# Altium project ESP32-HomeHub.PrjPcb
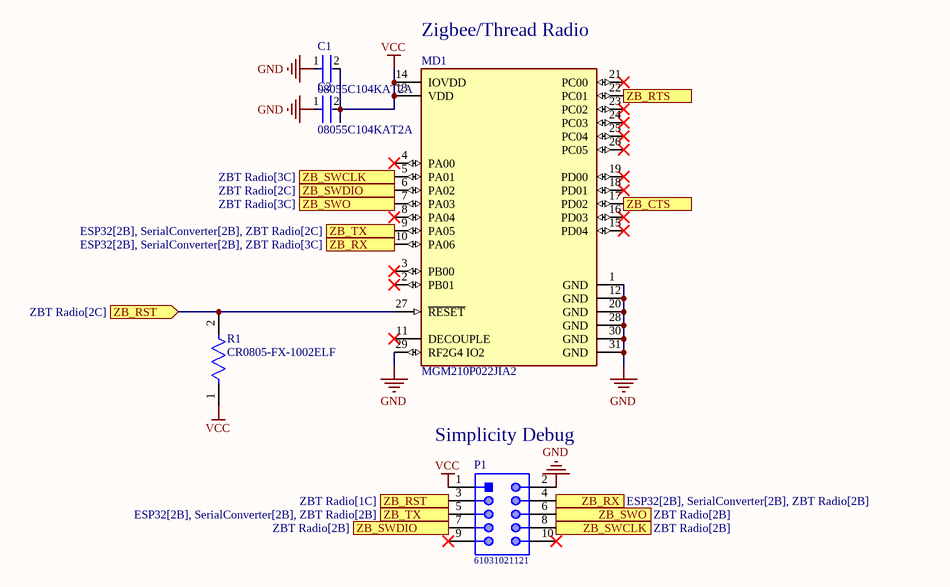
[diagram p0: ZBT Radio.SchDoc]
6 sheets, 52 parts. Net scope: flat (ports and power ports of the same name join across sheets).
Board file: PCB1.PcbDoc
Sheets:
  ZBT Radio.SchDoc
  ESP32.SchDoc
  SerialConverter.SchDoc
  Connectors.SchDoc
  PHY.SchDoc
  ZW Radio.SchDoc

## Sheet ZBT Radio.SchDoc
size A; SheetNumber: 1; SheetTotal: 6

### Parts
C1  08055C104KAT2A  [FP-0805-L_2_01_0_2-W_1_25-IPC_C]
C2  08055C104KAT2A  [FP-0805-L_2_01_0_2-W_1_25-IPC_C]
MD1  MGM210P022JIA2  [FP-MGM210P022JIA2-MFG]
P1  61031021121  [61031021121]
R1  CR0805-FX-1002ELF  [FP-CR0805-IPC_A]

### Ports
ZB_CTS, ZB_RST (in, see ZBT Radio[1C]), ZB_RST (in, see ZBT Radio[2C]), ZB_RTS, ZB_RX (in, see ESP32[2B], SerialConverter[2B], ZBT Radio[3C]), ZB_RX (out, see ESP32[2B], SerialConverter[2B], ZBT Radio[2B]), ZB_SWCLK (see ZBT Radio[2B]), ZB_SWCLK (see ZBT Radio[3C]), ZB_SWDIO (see ZBT Radio[2B]), ZB_SWDIO (see ZBT Radio[2C]), ZB_SWO (see ZBT Radio[2B]), ZB_SWO (see ZBT Radio[3C]), ZB_TX (in, see ESP32[2B], SerialConverter[2B], ZBT Radio[2B]), ZB_TX (out, see ESP32[2B], SerialConverter[2B], ZBT Radio[2C])

### Nets
GND: C1.1 C2.1 MD1.1(GND) MD1.12(GND) MD1.20(GND) MD1.28(GND) MD1.29(RF2G4_IO2) MD1.30(GND) MD1.31(GND) P1.2
VCC: C1.2 C2.2 MD1.13(VDD) MD1.14(IOVDD) P1.1 R1.1
ZB_CTS: MD1.17(PD02) ; port ZB_CTS
ZB_RST: MD1.27(~{RESET}) P1.3 R1.2 ; port ZB_RST
ZB_RTS: MD1.22(PC01) ; port ZB_RTS
ZB_RX: MD1.10(PA06) P1.4 ; port ZB_RX
ZB_SWCLK: MD1.5(PA01) P1.8 ; port ZB_SWCLK
ZB_SWDIO: MD1.6(PA02) P1.7 ; port ZB_SWDIO
ZB_SWO: MD1.7(PA03) P1.6 ; port ZB_SWO
ZB_TX: MD1.9(PA05) P1.5 ; port ZB_TX

Not connected (* = marked no-connect by the designer): MD1 2(PB01)* 3(PB00)* 4(PA00)* 8(PA04)* 11(DECOUPLE)* 15(PD04)* 16(PD03)* 18(PD01)* 19(PD00)* 21(PC00)* 23(PC02)* 24(PC03)* 25(PC04)* 26(PC05)*; P1 9* 10*

### Notes on the sheet
- (near MD1) Zigbee/Thread Radio
- (near P1) Simplicity Debug

### Library data of the parts
C1 C2 = CMP-2000-05016-2: General Purpose Ceramic Capacitor, 0805, 100nF, 10%, X7R, 0.15, 50V; Dissipation Factor: 2.5%; Insulation Resistance: 100GR; Voltage Rating (DC): 50V; Package Quantity: 4000; Tolerance: 10%; Voltage Rating: 50V; Dielectric: X7R; Case/Package: 0805; Lead Free: Lead Free; Dielectric Material: Ceramic; Thickness: 0.037inch; Weight: 0.001411oz; Max Operating Temperature: 125°C; REACH SVHC: No SVHC; Mount: Surface Mount; RoHS Compliant: Yes; Depth: 1.25mm; Height: 0.5mm; Case Code (Metric): 2012; Length: 2mm; Termination: Standard; Case Code (Imperial): 0805; Number of Pins: 2; Voltage: 50V; Radiation Hardening: No; Min Operating Temperature: -55°C; Capacitance: 100nF; Width: 1.2mm; Series: MLCC X7R; Packaging: Cut Tape
MD1 = CMP-08140-000019-1: RX TXRX MOD BLUETOOTH CHIP SMD
P1 = CMP-1502-01053-1: SMT Vertical Pin Header WR-PHD, Pitch 2.54 mm, Dual Row, 10 pins; Manufacturer: Wurth Elektronik; Gender: Male; Rated Current: 3A; Working Voltage: 250VAC; Withstanding Voltage: 500VAC; Pitch: 2.54mm; Pin Number: 10; Contact Resistance: 20mOhm; Packaging: TapeandReel; Part Number: 61031021121; Mounting Technology: SMT; Package Reference: 61031021121; Operating Temperature: -40to125degC; Manufacturer URL: http://www.we-online.de; Publisher: WurthElektronik; Datasheet URL: https://katalog.we-online.de/em/datasheet/6103xx21121.pdf; Orientation: Vertical; Row Number: Dual
R1 = CMP-07231-003204-1: Thick Film Chip Resistors 0805 10kΩ 0.125W 1% 100ppm/°C; Max Power Dissipation: 125mW; Voltage Rating: 150V; Voltage Rating (DC): 100V; Resistance: 10kR; Height: 0.5mm; Tolerance: 1%; Max Operating Temperature: 155°C; Thickness: 508um; Radiation Hardening: No; Packaging: Tape and Reel; Depth: 1.25mm; Contact Plating: Tin; Package Quantity: 1; Case Code (Metric): 2012; REACH SVHC: No SVHC; Min Operating Temperature: -55°C; Power Rating: 125mW; Mount: Surface Mount; Length: 2mm; Case Code (Imperial): 0805; Width: 1.25mm; Temperature Coefficient: 100ppm/°C; Termination: SMD/SMT; Composition: Thick Film; Features: Moisture Resistant; Case/Package: 0805; Number of Terminations: 2

## Sheet ESP32.SchDoc
size A; SheetNumber: 2; SheetTotal: 6
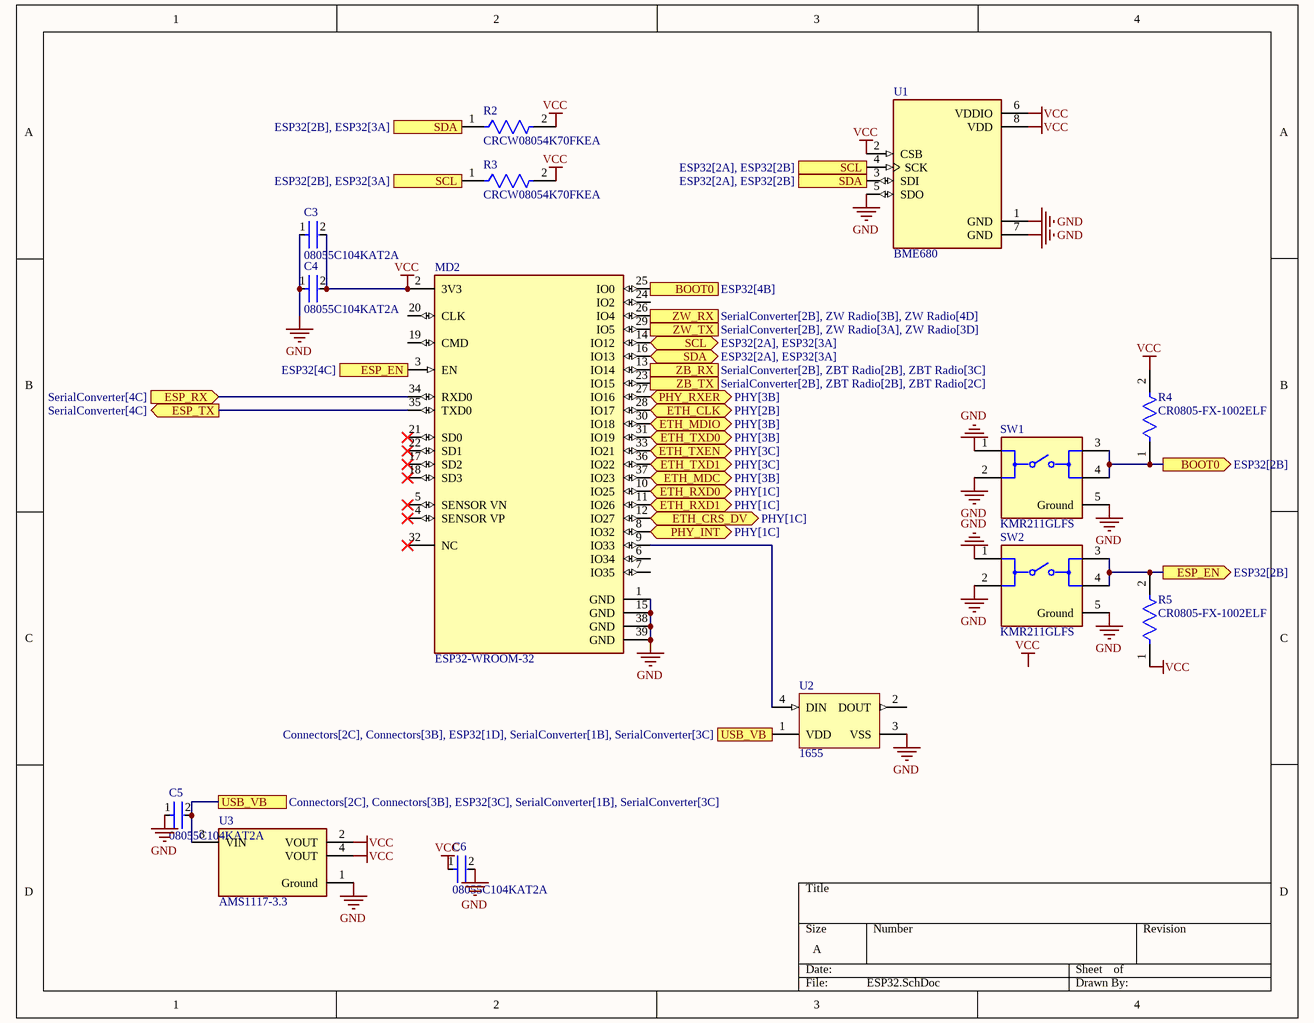
[diagram p1: ESP32.SchDoc]

### Parts
C3  08055C104KAT2A  [FP-0805-L_2_01_0_2-W_1_25-IPC_C]
C4  08055C104KAT2A  [FP-0805-L_2_01_0_2-W_1_25-IPC_C]
C5  08055C104KAT2A  [FP-0805-L_2_01_0_2-W_1_25-IPC_C]
C6  08055C104KAT2A  [FP-0805-L_2_01_0_2-W_1_25-IPC_C]
MD2  ESP32-WROOM-32  [FP-ESP32-WROOM-32-MFG]
R2  CRCW08054K70FKEA  [FP-CRCW0805-e3-IPC_B]
R3  CRCW08054K70FKEA  [FP-CRCW0805-e3-IPC_B]
R4  CR0805-FX-1002ELF  [FP-CR0805-IPC_A]
R5  CR0805-FX-1002ELF  [FP-CR0805-IPC_A]
SW1  KMR211GLFS  [FP-KMR211GLFS-MFG]
SW2  KMR211GLFS  [FP-KMR211GLFS-MFG]
U1  BME680  [PSON80P300X300X100-8N]
U2  1655  [ADA-RGB-1655_V]
U3  AMS1117-3.3  [FP-AMS1117-IPC_C]

### Ports
BOOT0 (in, see ESP32[4B]), BOOT0 (out, see ESP32[2B]), ESP_EN (in, see ESP32[4C]), ESP_EN (out, see ESP32[2B]), ESP_RX (in, see SerialConverter[4C]), ESP_TX (out, see SerialConverter[4C]), ETH_CLK (bidir, see PHY[2B]), ETH_CRS_DV (bidir, see PHY[1C]), ETH_MDC (bidir, see PHY[3B]), ETH_MDIO (bidir, see PHY[3B]), ETH_RXD0 (bidir, see PHY[1C]), ETH_RXD1 (bidir, see PHY[1C]), ETH_TXD0 (bidir, see PHY[3B]), ETH_TXD1 (bidir, see PHY[3C]), ETH_TXEN (bidir, see PHY[3C]), PHY_INT (bidir, see PHY[1C]), PHY_RXER (bidir, see PHY[3B]), SCL (bidir, see ESP32[2A], ESP32[3A]), SCL (see ESP32[2A], ESP32[2B]), SCL (see ESP32[2B], ESP32[3A]), SDA (bidir, see ESP32[2A], ESP32[3A]), SDA (see ESP32[2A], ESP32[2B]), SDA (see ESP32[2B], ESP32[3A]), USB_VB (see Connectors[2C], Connectors[3B], ESP32[1D], SerialConverter[1B], SerialConverter[3C]), USB_VB (see Connectors[2C], Connectors[3B], ESP32[3C], SerialConverter[1B], SerialConverter[3C]), ZB_RX (out, see SerialConverter[2B], ZBT Radio[2B], ZBT Radio[3C]), ZB_TX (in, see SerialConverter[2B], ZBT Radio[2B], ZBT Radio[2C]), ZW_RX (out, see SerialConverter[2B], ZW Radio[3B], ZW Radio[4D]), ZW_TX (in, see SerialConverter[2B], ZW Radio[3A], ZW Radio[3D])

### Nets
GND: C3.1 C4.1 C5.1 C6.2 MD2.1(GND) MD2.15(GND) MD2.38(GND) MD2.39(GND) SW1.1 SW1.2 SW1.5(Ground) SW2.1 SW2.2 SW2.5(Ground) U1.1(GND) U1.5(SDO) U1.7(GND) U2.3(VSS) U3.1(Ground)
VCC: C3.2 C4.2 C6.1 MD2.2(3V3) R2.2 R3.2 R4.2 R5.1 U1.2(CSB) U1.6(VDDIO) U1.8(VDD) U3.2(VOUT) U3.4(VOUT)
BOOT0: MD2.25(IO0) R4.1 SW1.3 SW1.4 ; port BOOT0
ESP_EN: MD2.3(EN) R5.2 SW2.3 SW2.4 ; port ESP_EN
ESP_RX: MD2.34(RXD0) ; port ESP_RX
ESP_TX: MD2.35(TXD0) ; port ESP_TX
ETH_CLK: MD2.28(IO17) ; port ETH_CLK
ETH_CRS_DV: MD2.12(IO27) ; port ETH_CRS_DV
ETH_MDC: MD2.37(IO23) ; port ETH_MDC
ETH_MDIO: MD2.30(IO18) ; port ETH_MDIO
ETH_RXD0: MD2.10(IO25) ; port ETH_RXD0
ETH_RXD1: MD2.11(IO26) ; port ETH_RXD1
ETH_TXD0: MD2.31(IO19) ; port ETH_TXD0
ETH_TXD1: MD2.36(IO22) ; port ETH_TXD1
ETH_TXEN: MD2.33(IO21) ; port ETH_TXEN
PHY_INT: MD2.8(IO32) ; port PHY_INT
PHY_RXER: MD2.27(IO16) ; port PHY_RXER
SCL: MD2.14(IO12) R3.1 U1.4(SCK) ; port SCL
SDA: MD2.16(IO13) R2.1 U1.3(SDI) ; port SDA
USB_VB: C5.2 U2.1(VDD) U3.3(VIN) ; port USB_VB
ZB_RX: MD2.13(IO14) ; port ZB_RX
ZB_TX: MD2.23(IO15) ; port ZB_TX
ZW_RX: MD2.26(IO4) ; port ZW_RX
ZW_TX: MD2.29(IO5) ; port ZW_TX
NetMD2_9: MD2.9(IO33) U2.4(DIN)

Not connected (* = marked no-connect by the designer): MD2 4(SENSOR_VP)* 5(SENSOR_VN)* 6(IO34) 7(IO35) 17(SD2)* 18(SD3)* 19(CMD) 20(CLK) 21(SD0)* 22(SD1)* 24(IO2) 32(NC)*; U2 2(DOUT)

### Notes on the sheet
- Labels drawn without touching a wire or pin: VCC

### Library data of the parts
C3-C6 = CMP-2000-05016-2: as C1 on sheet ZBT Radio; Voltage Rating (DC): 50V; Package Quantity: 4000; Tolerance: 10%; Voltage Rating: 50V; Dielectric: X7R; Case/Package: 0805; Lead Free: Lead Free; Dielectric Material: Ceramic; Thickness: 0.037inch; Weight: 0.001411oz; Max Operating Temperature: 125°C; REACH SVHC: No SVHC; Mount: Surface Mount; RoHS Compliant: Yes; Depth: 1.25mm; Height: 0.5mm; Case Code (Metric): 2012; Length: 2mm; Termination: Standard; Case Code (Imperial): 0805; Number of Pins: 2; Voltage: 50V; Radiation Hardening: No; Min Operating Temperature: -55°C; Capacitance: 100nF; Width: 1.2mm; Series: MLCC X7R; Packaging: Cut Tape
MD2 = CMP-194065-000008-1: RX TXRX MOD WIFI SURFACE MOUNT; Frequency: 2.5GHz; Sensitivity: -98dBm; Operating Supply Voltage: 3.6V; Data Rate: 150Mbps; Weight: 0.088185oz; Package Quantity: 550; Min Operating Temperature: -40°C; Mount: Surface Mount; Max Operating Temperature: 85°C; Packaging: Cut Tape; Case/Package: SMD/SMT
R2 R3 = CMP-2100-03615-2: RES Thick Film, 4.7kΩ, 1%, 0.125W, 100ppm/°C, 0805; Max Power Dissipation: 125mW; Resistance: 4.7kR; Voltage Rating: 150V; Termination: SMD/SMT; Weight: 0.000194oz; Case/Package: 0805; Number of Terminations: 2; Min Operating Temperature: -55°C; Case Code (Metric): 2012; Package Quantity: 10; Depth: 1.25mm; Military Standard: Not; Composition: Thick Film; Radiation Hardening: No; Contact Plating: Tin; Height: 0.45mm; Power Rating: 125mW; Features: Automotive AEC-Q200; Tolerance: 1%; Packaging: Tape and Reel; Max Operating Temperature: 155°C; Length: 2mm; Case Code (Imperial): 0805; Voltage Rating (DC): 150V; Width: 1.25mm; Temperature Coefficient: 100ppm/°C; Lead Free: Lead Free
R4 R5 = CMP-07231-003204-1: as R1 on sheet ZBT Radio; Height: 0.5mm; Tolerance: 1%; Max Operating Temperature: 155°C; Thickness: 508um; Radiation Hardening: No; Packaging: Tape and Reel; Depth: 1.25mm; Contact Plating: Tin; Package Quantity: 1; Case Code (Metric): 2012; REACH SVHC: No SVHC; Min Operating Temperature: -55°C; Power Rating: 125mW; Mount: Surface Mount; Length: 2mm; Case Code (Imperial): 0805; Width: 1.25mm; Temperature Coefficient: 100ppm/°C; Termination: SMD/SMT; Composition: Thick Film; Features: Moisture Resistant; Case/Package: 0805; Number of Terminations: 2
SW1 SW2 = CMP-10040-000023-1: SWITCH TACTILE SPST-NO 0.05A 32V; Switch Function: Off-Mom; Throw Configuration: SPST; Switch Travel: 0.2mm; Current Rating: 50mA; Illumination Type: Non-Illuminated; Actuator Length: 0.5mm; Power Rating: 1W; Operating Force: 1.2N; Actuator Type: Standard; Mechanical Life: 200000Cycles; REACH SVHC: No SVHC; Voltage Rating (DC): 32V; Length: 2.8mm; Min Operating Temperature: -40°C; Mount: Surface Mount; Max Voltage Rating (DC): 32V; Width: 2.8mm; Depth: 4.6mm; Packaging: Tape and Reel; Lead Free: Lead Free; Contact Material: Silver; Termination: Gull Wing; Package Quantity: 1; Contact Current Rating: 50mA; Orientation: Straight; Max Operating Temperature: 85°C; Radiation Hardening: No; Max Current Rating: 50mA; Contact Plating: Silver
U1 = BME680: Integrated Environmental Unit; MF: {'manufacturer': u'Bosch Sensortec'}; Package: None; Price: None; Value: *; MP: BME680; Availability: Unavailable
U2 = CMP-2000-05026-1: Intelligent Control LED Integrated Light Source, 3.5 to 5.3 V, -25 to 80 degC, 4-Pin SMD, RoHS, Tape and Reel; Manufacturer: Adafruit-Industries-LLC; Number of LEDs: 10; Configuration: Discrete; Utilized LED: WS2812(5050); Datasheet URL: http://datasheet.octopart.com/ADA1655-Adafruit-Industries-datasheet-32028139.pdf; Series: Neopixel; Interface: -; Package Description: 4-Pin Surface Mount Device, Body 5 x 5 mm; Color: Red,Green,Blue(RGB); Category: Optoelectronics; Controller Type: -; Package Reference: 1655; Manufacturer URL: https://www.adafruit.com/; Mounting Type: SurfaceMount; Datasheet Version: May-13; Size / Dimension: 5.00mmLx5.00mmW; Family: Addressable,Specialty
U3 = CMP-209535-000001-1: LDO Voltage Regulators 1A, 3.3V; Manufacturer: Advanced Monolithic Systems; Dropout Voltage: 1.1V; Output Type: Fixed; Nominal Supply Current: 5mA; Max Power Dissipation: 1.2W; Max Supply Voltage: 15V; Number Of Outputs: 1; Standoff Height: 0.64mm; Max Junction Temp: +125°C; Height: 1.8mm; Package: AMS1117; Device Class L2: Power Management ICs; ComponentLink2Description: Datasheet; ComponentLink2URL: http://www.advanced-monolithic.com/pdf/ds1117.pdf; Category: IC; RoHS: TRUE; Automotive: No; Device Class L1: Integrated Circuits (ICs); Output Current: 1A; Device Class L3: Voltage Regulators - Linear; Temperature: -40°C to +125°C; Output Voltage: 3.3V; Manufacturer Part Number: AMS1117-3.3; Temperature Range Low: -40°C; Octopart: https://octopart.com/ams1117-3.3-advanced+monolithic+systems-25899300; Lead Free: Yes; Ipc Land Pattern Name: SOT229P700X180-4; Temperature Range High: +125°C

## Sheet SerialConverter.SchDoc
size A; SheetNumber: 3; SheetTotal: 6
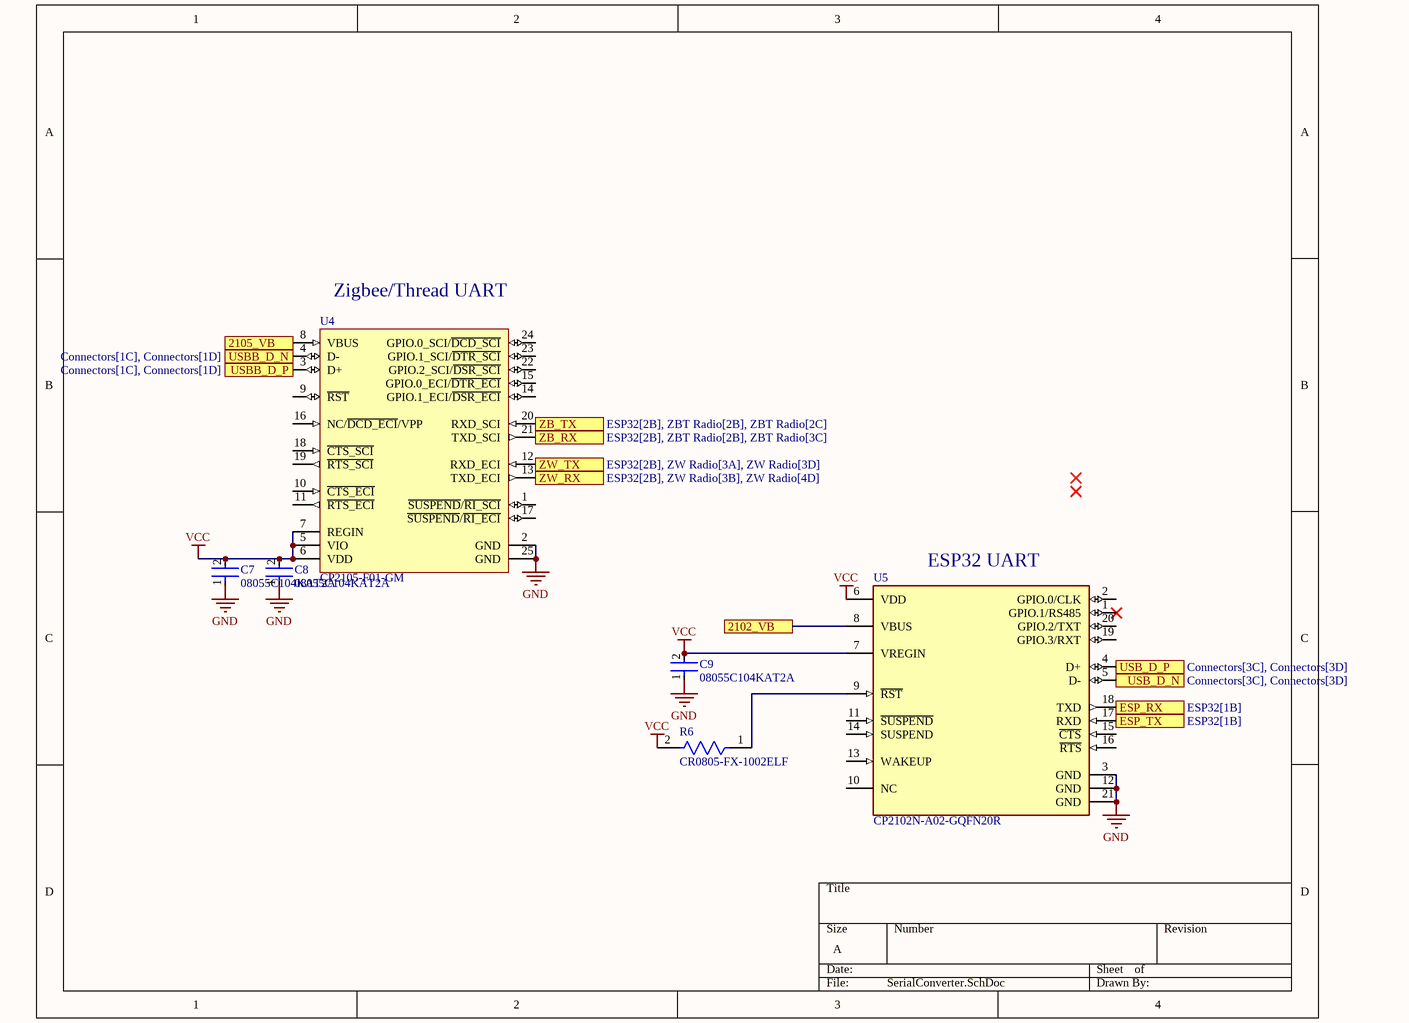
[diagram p2: SerialConverter.SchDoc]

### Parts
C7  08055C104KAT2A  [FP-0805-L_2_01_0_2-W_1_25-IPC_C]
C8  08055C104KAT2A  [FP-0805-L_2_01_0_2-W_1_25-IPC_C]
C9  08055C104KAT2A  [FP-0805-L_2_01_0_2-W_1_25-IPC_C]
R6  CR0805-FX-1002ELF  [FP-CR0805-IPC_A]
U4  CP2105-F01-GM  [SLAB-QFN-24-2675x2675TP_N]
U5  CP2102N-A02-GQFN20R  [FP-CP2102N-A02-GQFN20R-MFG]

### Ports
2102_VB, 2105_VB, ESP_RX (out, see ESP32[1B]), ESP_TX (in, see ESP32[1B]), USB_D_N (see Connectors[3C], Connectors[3D]), USB_D_P (see Connectors[3C], Connectors[3D]), USBB_D_N (see Connectors[1C], Connectors[1D]), USBB_D_P (see Connectors[1C], Connectors[1D]), ZB_RX (out, see ESP32[2B], ZBT Radio[2B], ZBT Radio[3C]), ZB_TX (in, see ESP32[2B], ZBT Radio[2B], ZBT Radio[2C]), ZW_RX (out, see ESP32[2B], ZW Radio[3B], ZW Radio[4D]), ZW_TX (in, see ESP32[2B], ZW Radio[3A], ZW Radio[3D])

### Nets
GND: C7.1 C8.1 C9.1 U4.2(GND) U4.25(GND) U5.3(GND) U5.12(GND) U5.21(GND)
VCC: C7.2 C8.2 C9.2 R6.2 U4.5(VIO) U4.6(VDD) U4.7(REGIN) U5.6(VDD) U5.7(VREGIN)
2102_VB: U5.8(VBUS) ; port 2102_VB
2105_VB: U4.8(VBUS) ; port 2105_VB
ESP_RX: U5.18(TXD) ; port ESP_RX
ESP_TX: U5.17(RXD) ; port ESP_TX
USB_D_N: U5.5(D-) ; port USB_D_N
USB_D_P: U5.4(D+) ; port USB_D_P
USBB_D_N: U4.4(D-) ; port USBB_D_N
USBB_D_P: U4.3(D+) ; port USBB_D_P
ZB_RX: U4.21(TXD_SCI) ; port ZB_RX
ZB_TX: U4.20(RXD_SCI) ; port ZB_TX
ZW_RX: U4.13(TXD_ECI) ; port ZW_RX
ZW_TX: U4.12(RXD_ECI) ; port ZW_TX
NetR6_1: R6.1 U5.9(~{RST})

Not connected (* = marked no-connect by the designer): U4 1(~{SUSPEND}/~{RI_SCI}) 9(~{RST}) 10(~{CTS_ECI}) 11(~{RTS_ECI}) 14(GPIO.1_ECI/~{DSR_ECI}) 15(GPIO.0_ECI/~{DTR_ECI}) 16(NC/~{DCD_ECI}/VPP) 17(~{SUSPEND}/~{RI_ECI}) 18(~{CTS_SCI}) 19(~{RTS_SCI}) 22(GPIO.2_SCI/~{DSR_SCI}) 23(GPIO.1_SCI/~{DTR_SCI}) 24(GPIO.0_SCI/~{DCD_SCI}); U5 1(GPIO.1/RS485)* 2(GPIO.0/CLK) 10(NC) 11(~{SUSPEND}) 13(WAKEUP) 14(SUSPEND) 15(~{CTS}) 16(~{RTS}) 19(GPIO.3/RXT) 20(GPIO.2/TXT)

### Notes on the sheet
- (near U4) Zigbee/Thread UART
- (near U5) ESP32 UART

### Library data of the parts
C7-C9 = CMP-2000-05016-2: as C1 on sheet ZBT Radio; Voltage Rating (DC): 50V; Package Quantity: 4000; Tolerance: 10%; Voltage Rating: 50V; Dielectric: X7R; Case/Package: 0805; Lead Free: Lead Free; Dielectric Material: Ceramic; Thickness: 0.037inch; Weight: 0.001411oz; Max Operating Temperature: 125°C; REACH SVHC: No SVHC; Mount: Surface Mount; RoHS Compliant: Yes; Depth: 1.25mm; Height: 0.5mm; Case Code (Metric): 2012; Length: 2mm; Termination: Standard; Case Code (Imperial): 0805; Number of Pins: 2; Voltage: 50V; Radiation Hardening: No; Min Operating Temperature: -55°C; Capacitance: 100nF; Width: 1.2mm; Series: MLCC X7R; Packaging: Cut Tape
R6 = CMP-07231-003204-1: as R1 on sheet ZBT Radio; Height: 0.5mm; Tolerance: 1%; Max Operating Temperature: 155°C; Thickness: 508um; Radiation Hardening: No; Packaging: Tape and Reel; Depth: 1.25mm; Contact Plating: Tin; Package Quantity: 1; Case Code (Metric): 2012; REACH SVHC: No SVHC; Min Operating Temperature: -55°C; Power Rating: 125mW; Mount: Surface Mount; Length: 2mm; Case Code (Imperial): 0805; Width: 1.25mm; Temperature Coefficient: 100ppm/°C; Termination: SMD/SMT; Composition: Thick Film; Features: Moisture Resistant; Case/Package: 0805; Number of Terminations: 2
U4 = CMP-0511-00003-1: Single-Chip USB to Dual UART Bridge, 5 Dig I/O Pins, Internal Oscillator, 296 Bytes EEPROM, -40 to 85 degC, 24-pin QFN; Manufacturer: Silicon Labs; Internal Oscillator: TRUE; Sub-Family: USB Bridges; ComponentLink3URL: http://www.silabs.com/Support%20Documents/TechnicalDocs/C8051F93x-92x.pdf; PartNumber: CP2105-F01-GM; PackageDescription: 24-Pin Quad-Flat No-Leads Package, Body 4 x 4 mm, Pitch 0.5 mm; Code_JEDEC: MO-220; ComponentLink2URL: http://www.silabs.com/Support%20Documents/TechnicalDocs/CP2105.pdf; Mounting Technology: Surface Mount; ComponentLink1URL: http://www.silabs.com/; ComponentLink1Description: Manufacturer URL; EEPROM: 296 Bytes; ComponentLink2Description: Datasheet; ComponentLink3Description: Package Specification; Code_IPC: J-STD-020; DatasheetVersion: Rev. 1.0; PackageReference: QFN-24
U5 = CMP-08107-000007-1: IC USB TO UART BRIDGE QFN20

## Sheet Connectors.SchDoc
size A; SheetNumber: 4; SheetTotal: 6
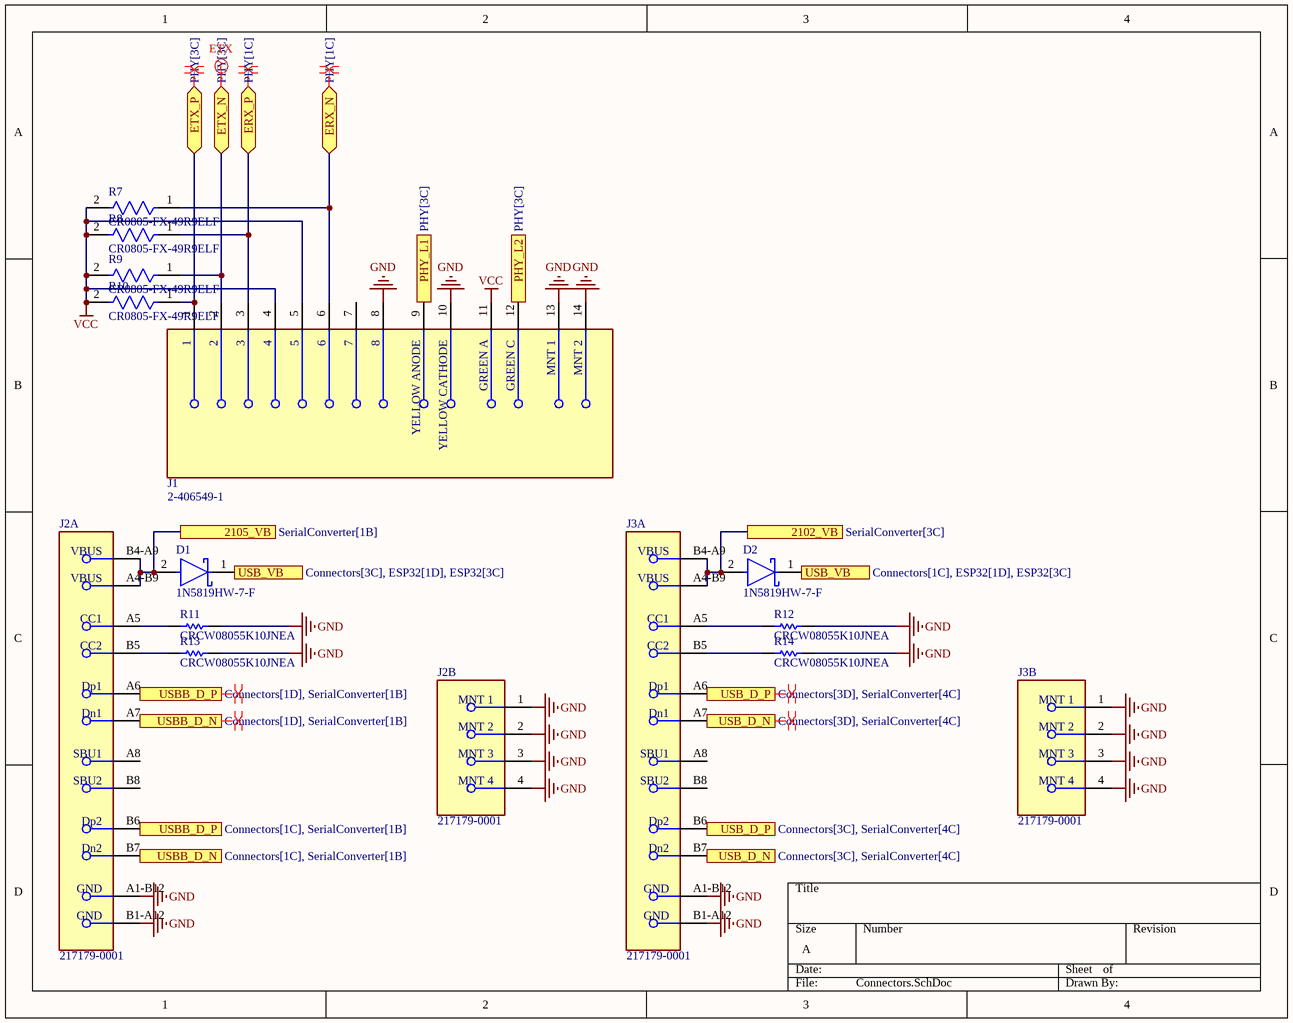
[diagram p3: Connectors.SchDoc]

### Parts
D1  1N5819HW-7-F  [FP-SOD123-IPC_A]
D2  1N5819HW-7-F  [FP-SOD123-IPC_A]
J1  2-406549-1  [FP-2-406549-1-MFG]
J2  217179-0001  [FP-217179-0001-MFG]  (parts A,B of 2)
J3  217179-0001  [FP-217179-0001-MFG]  (parts A,B of 2)
R7  CR0805-FX-49R9ELF  [FP-CR0805-MFG]
R8  CR0805-FX-49R9ELF  [FP-CR0805-MFG]
R9  CR0805-FX-49R9ELF  [FP-CR0805-MFG]
R10  CR0805-FX-49R9ELF  [FP-CR0805-MFG]
R11  CRCW08055K10JNEA  [RESC2013X50X30LL20T20]
R12  CRCW08055K10JNEA  [RESC2013X50X30LL20T20]
R13  CRCW08055K10JNEA  [RESC2013X50X30LL20T20]
R14  CRCW08055K10JNEA  [RESC2013X50X30LL20T20]

### Ports
2102_VB (see SerialConverter[3C]), 2105_VB (see SerialConverter[1B]), ERX_N (bidir, see PHY[1C]), ERX_P (bidir, see PHY[1C]), ETX_N (bidir, see PHY[3C]), ETX_P (bidir, see PHY[3C]), PHY_L1 (in, see PHY[3C]), PHY_L2 (out, see PHY[3C]), USB_D_N (see Connectors[3C], SerialConverter[4C]), USB_D_N (see Connectors[3D], SerialConverter[4C]), USB_D_P (see Connectors[3C], SerialConverter[4C]), USB_D_P (see Connectors[3D], SerialConverter[4C]), USB_VB (see Connectors[1C], ESP32[1D], ESP32[3C]), USB_VB (see Connectors[3C], ESP32[1D], ESP32[3C]), USBB_D_N (see Connectors[1C], SerialConverter[1B]), USBB_D_N (see Connectors[1D], SerialConverter[1B]), USBB_D_P (see Connectors[1C], SerialConverter[1B]), USBB_D_P (see Connectors[1D], SerialConverter[1B])

### Nets
GND: J1.8 J1.10(YELLOW_CATHODE) J1.13(MNT_1) J1.14(MNT_2) J2.1(MNT_1) J2.2(MNT_2) J2.3(MNT_3) J2.4(MNT_4) J2.A1-B12(GND) J2.B1-A12(GND) J3.1(MNT_1) J3.2(MNT_2) J3.3(MNT_3) J3.4(MNT_4) J3.A1-B12(GND) J3.B1-A12(GND) R11.2 R12.2 R13.2 R14.2
VCC: J1.4 J1.5 J1.11(GREEN_A) R7.2 R8.2 R9.2 R10.2
2102_VB: D2.2(A) J3.A4-B9(VBUS) J3.B4-A9(VBUS) ; port 2102_VB
2105_VB: D1.2(A) J2.A4-B9(VBUS) J2.B4-A9(VBUS) ; port 2105_VB
ERX_N: J1.6 R7.1 ; port ERX_N
ERX_P: J1.3 R8.1 ; port ERX_P
ETX_N: J1.2 R9.1 ; port ETX_N
ETX_P: J1.1 R10.1 ; port ETX_P
PHY_L1: J1.9(YELLOW_ANODE) ; port PHY_L1
PHY_L2: J1.12(GREEN_C) ; port PHY_L2
USB_D_N: J3.A7(Dn1) J3.B7(Dn2) ; port USB_D_N
USB_D_P: J3.A6(Dp1) J3.B6(Dp2) ; port USB_D_P
USB_VB: D1.1(C) D2.1(C) ; port USB_VB
USBB_D_N: J2.A7(Dn1) J2.B7(Dn2) ; port USBB_D_N
USBB_D_P: J2.A6(Dp1) J2.B6(Dp2) ; port USBB_D_P
NetJ2_A5: J2.A5(CC1) R11.1
NetJ2_B5: J2.B5(CC2) R13.1
NetJ3_A5: J3.A5(CC1) R12.1
NetJ3_B5: J3.B5(CC2) R14.1

Not connected (* = marked no-connect by the designer): J1 7; J2 A8(SBU1) B8(SBU2); J3 A8(SBU1) B8(SBU2)

### Layout directives
differential pair: ERX_N, ERX_P, ETX_N, ETX_P, USB_D_N, USB_D_P, USBB_D_N, USBB_D_P

### Library data of the parts
D1 D2 = CMP-0303-00003-3: DIODE SCHOTTKY 40V 1A SOD123; Forward Voltage: 450mV; Capacitance: 110pF; Max Forward Surge Current (Ifsm): 25A; Peak Reverse Current: 50uA; Polarity: Standard; Element Configuration: Single; Max Power Dissipation: 450mW; Min Operating Temperature: -65°C; Package Quantity: 3000; Contact Plating: Tin; Weight: 0.000353oz; Max Repetitive Reverse Voltage (Vrrm): 40V; Max Reverse Voltage (DC): 40V; Height: 1.25mm; Average Rectified Current: 1A; Width: 1.7mm; Case/Package: SOD-123-2; Lead Free: Lead Free; Max Operating Temperature: 125°C; Current Rating: 1A; Termination: SMD/SMT; Forward Current: 1A; Radiation Hardening: No; Number of Pins: 2; Length: 2.85mm; Voltage Rating (DC): 40V; REACH SVHC: No SVHC; Peak Non-Repetitive Surge Current: 25A; Packaging: Tape and Reel; Output Current: 1A
J1 = CMP-2000-05541-2: CONN MOD JACK 8P8C R/A SHIELDED; Max Voltage Rating (AC): 150V; Number of Contacts: 8; PCB Mounting Orientation: Right Angle; Direction: Up; Pitch: 2.03mm; Number of Ports: 1; Gender: Female; Tail Length: 2.54mm; Current Rating: 1.5A; Keyed: No; Approvals: UL; PCB Thickness: 1.57mm; Element Configuration: Single; Connector Type: Jack; Color: Yellow; Max Operating Temperature: 85°C; Weight: 0.144729oz; Series: -; Orientation: Right Angle; Width: 17.27mm; Package Quantity: 63; Mount: Panel; Contact Plating: Gold; Length: 17.86mm; Depth: 15.75mm; Flammability Rating: UL94 V-0; Shielding: Shielded; Housing Material: Thermoplastic; Number of Positions Loaded: 8; Contact Material: Bronze; Voltage Rating: 150V; Packaging: Tray; Number of Positions: 8; Termination: Solder; Number of Rows: 1; Radiation Hardening: No; Min Operating Temperature: -40°C; RoHS Compliant: Yes; Housing Color: Black
J2 J3 = CMP-04767-000028-1: CONN RCP USB2.0 TYP C 24P SMD RA
R7-R10 = CMP-07231-001472-1: Thick Film Chip Resistors 0805 49.9Ω 0.125W 1% 100ppm/°C; Voltage Rating (DC): 150V; Power Rating: 125mW; Resistance: 49.9R; Contact Plating: Tin; Radiation Hardening: No; Height: 0.5mm; Tolerance: 1%; Temperature Coefficient: 100ppm/°C; Min Operating Temperature: -55°C; Thickness: 508um; Termination: SMD/SMT; Depth: 1.25mm; Length: 2mm; Number of Pins: 2; Military Standard: Not; Case Code (Metric): 2012; Package Quantity: 5000; Width: 1.25mm; Mount: Surface Mount; Case Code (Imperial): 0805; Max Operating Temperature: 155°C; Voltage Rating: 150V; Composition: Thick Film; Case/Package: 0805; Packaging: Tape and Reel; REACH SVHC: No SVHC
R11-R14 = CMP-2001-04025-1: Manufacturer: Vishay Dale; Part Number: CRCW08055K10JNEA

## Sheet PHY.SchDoc
size A; SheetNumber: 5; SheetTotal: 6
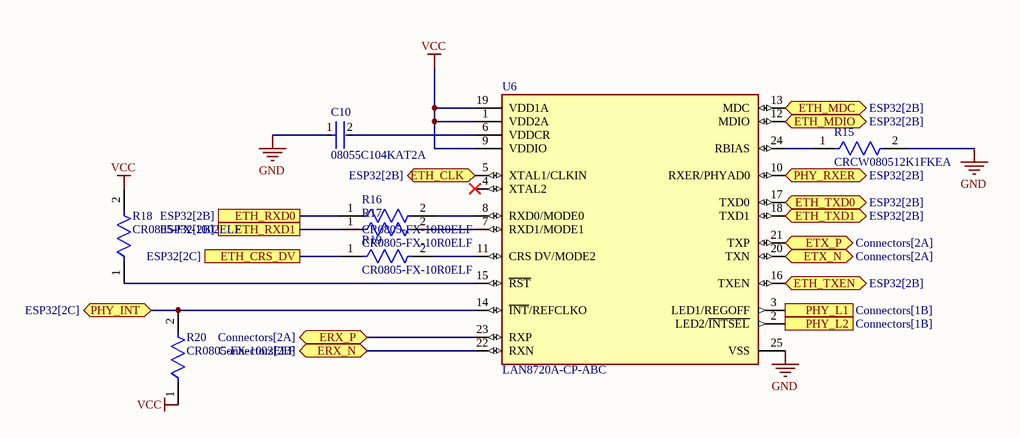
[diagram p4: PHY.SchDoc]

### Parts
C10  08055C104KAT2A  [FP-0805-L_2_01_0_2-W_1_25-IPC_C]
R15  CRCW080512K1FKEA  [FP-CRCW0805-e3-IPC_B]
R16  CR0805-FX-10R0ELF  [FP-CR0805-IPC_B]
R17  CR0805-FX-10R0ELF  [FP-CR0805-IPC_B]
R18  CR0805-FX-1002ELF  [FP-CR0805-IPC_A]
R19  CR0805-FX-10R0ELF  [FP-CR0805-IPC_B]
R20  CR0805-FX-1002ELF  [FP-CR0805-IPC_A]
U6  LAN8720A-CP-ABC  [FP-24-S4QFN-4x4B-0_5P-IPC_B]

### Ports
ERX_N (bidir, see Connectors[2B]), ERX_P (bidir, see Connectors[2A]), ETH_CLK (bidir, see ESP32[2B]), ETH_CRS_DV (see ESP32[2C]), ETH_MDC (bidir, see ESP32[2B]), ETH_MDIO (bidir, see ESP32[2B]), ETH_RXD0 (see ESP32[2B]), ETH_RXD1 (see ESP32[2B]), ETH_TXD0 (bidir, see ESP32[2B]), ETH_TXD1 (bidir, see ESP32[2B]), ETH_TXEN (bidir, see ESP32[2B]), ETX_N (bidir, see Connectors[2A]), ETX_P (bidir, see Connectors[2A]), PHY_INT (bidir, see ESP32[2C]), PHY_L1 (out, see Connectors[1B]), PHY_L2 (out, see Connectors[1B]), PHY_RXER (bidir, see ESP32[2B])

### Nets
GND: C10.1 R15.2 U6.25(VSS)
VCC: R18.2 R20.1 U6.1(VDD2A) U6.9(VDDIO) U6.19(VDD1A)
ERX_N: U6.22(RXN) ; port ERX_N
ERX_P: U6.23(RXP) ; port ERX_P
ETH_CLK: U6.5(XTAL1/CLKIN) ; port ETH_CLK
ETH_CRS_DV: R19.1 ; port ETH_CRS_DV
ETH_MDC: U6.13(MDC) ; port ETH_MDC
ETH_MDIO: U6.12(MDIO) ; port ETH_MDIO
ETH_RXD0: R16.1 ; port ETH_RXD0
ETH_RXD1: R17.1 ; port ETH_RXD1
ETH_TXD0: U6.17(TXD0) ; port ETH_TXD0
ETH_TXD1: U6.18(TXD1) ; port ETH_TXD1
ETH_TXEN: U6.16(TXEN) ; port ETH_TXEN
ETX_N: U6.20(TXN) ; port ETX_N
ETX_P: U6.21(TXP) ; port ETX_P
PHY_INT: R20.2 U6.14(~{INT}/REFCLKO) ; port PHY_INT
PHY_L1: U6.3(LED1/REGOFF) ; port PHY_L1
PHY_L2: U6.2(LED2/~{INTSEL}) ; port PHY_L2
PHY_RXER: U6.10(RXER/PHYAD0) ; port PHY_RXER
NetC10_2: C10.2 U6.6(VDDCR)
NetR15_1: R15.1 U6.24(RBIAS)
NetR16_2: R16.2 U6.8(RXD0/MODE0)
NetR17_2: R17.2 U6.7(RXD1/MODE1)
NetR18_1: R18.1 U6.15(~{RST})
NetR19_2: R19.2 U6.11(CRS_DV/MODE2)

Not connected (* = marked no-connect by the designer): U6 4(XTAL2)*

### Library data of the parts
C10 = CMP-2000-05016-2: as C1 on sheet ZBT Radio; Voltage Rating (DC): 50V; Package Quantity: 4000; Tolerance: 10%; Voltage Rating: 50V; Dielectric: X7R; Case/Package: 0805; Lead Free: Lead Free; Dielectric Material: Ceramic; Thickness: 0.037inch; Weight: 0.001411oz; Max Operating Temperature: 125°C; REACH SVHC: No SVHC; Mount: Surface Mount; RoHS Compliant: Yes; Depth: 1.25mm; Height: 0.5mm; Case Code (Metric): 2012; Length: 2mm; Termination: Standard; Case Code (Imperial): 0805; Number of Pins: 2; Voltage: 50V; Radiation Hardening: No; Min Operating Temperature: -55°C; Capacitance: 100nF; Width: 1.2mm; Series: MLCC X7R; Packaging: Cut Tape
R15 = CMP-2001-04935-2: RES Thick Film, 12.1kΩ, 1%, 0.125W, 100ppm/°C, 0805; Max Power Dissipation: 125mW; Resistance: 12.1kR; Voltage Rating: 150V; Min Operating Temperature: -55°C; Power Rating: 125mW; Length: 2mm; Tolerance: 1%; Termination: SMD/SMT; Height: 0.45mm; Radiation Hardening: No; Case/Package: 0805; Packaging: Tape and Reel; Lead Free: Lead Free; Military Standard: Not; Max Operating Temperature: 155°C; Features: Automotive AEC-Q200; Voltage Rating (DC): 150V; Width: 0.049inch; Case Code (Imperial): 0805; Depth: 1.25mm; Temperature Coefficient: 100ppm/°C; Weight: 0.000194oz; Composition: Thick Film; Case Code (Metric): 2012; Number of Terminations: 2; Package Quantity: 10; Contact Plating: Tin
R16 R17 R19 = CMP-07231-004657-1: Thick Film Chip Resistors 0805 10Ω 0.125W 1% 100ppm/°C; Voltage Rating (DC): 150V; Resistance: 10R; Power Rating: 125mW; Tolerance: 1%; Min Operating Temperature: -55°C; Length: 2mm; Case Code (Metric): 2012; Temperature Coefficient: 100ppm/°C; Height: 0.5mm; Max Operating Temperature: 155°C; Case/Package: 0805; Width: 1.25mm; Composition: Thick Film; Contact Plating: Tin; Termination: SMD/SMT; Packaging: Tape and Reel; REACH SVHC: No SVHC; Number of Pins: 2; Package Quantity: 5000; Mount: Surface Mount; Military Standard: Not; Thickness: 508um; Case Code (Imperial): 0805; Depth: 1.25mm; Radiation Hardening: No; Voltage Rating: 150V
R18 R20 = CMP-07231-003204-1: as R1 on sheet ZBT Radio; Height: 0.5mm; Tolerance: 1%; Max Operating Temperature: 155°C; Thickness: 508um; Radiation Hardening: No; Packaging: Tape and Reel; Depth: 1.25mm; Contact Plating: Tin; Package Quantity: 1; Case Code (Metric): 2012; REACH SVHC: No SVHC; Min Operating Temperature: -55°C; Power Rating: 125mW; Mount: Surface Mount; Length: 2mm; Case Code (Imperial): 0805; Width: 1.25mm; Temperature Coefficient: 100ppm/°C; Termination: SMD/SMT; Composition: Thick Film; Features: Moisture Resistant; Case/Package: 0805; Number of Terminations: 2
U6 = CMP-06281-000057-1: IC TRANSCEIVER FULL 2/2 24SQFN

## Sheet ZW Radio.SchDoc
size A; SheetNumber: 6; SheetTotal: 6
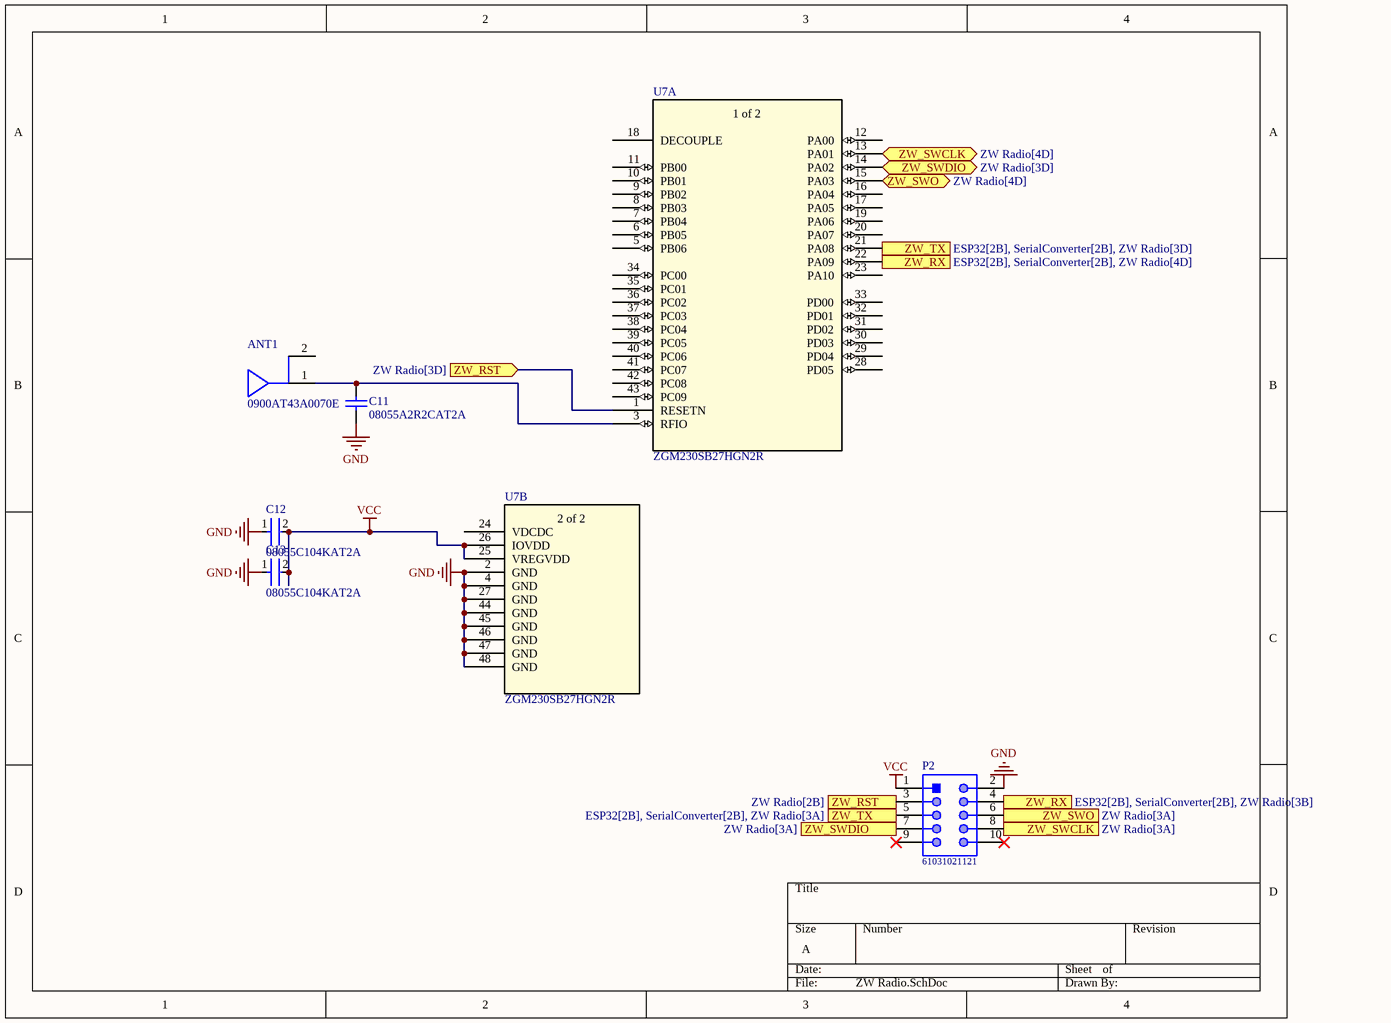
[diagram p5: ZW Radio.SchDoc]

### Parts
ANT1  0900AT43A0070E  [FP-0900AT43A0070E-MFG]
C11  08055A2R2CAT2A  [CAPC2013X94X50NL20T25]
C12  08055C104KAT2A  [FP-0805-L_2_01_0_2-W_1_25-IPC_C]
C13  08055C104KAT2A  [FP-0805-L_2_01_0_2-W_1_25-IPC_C]
P2  61031021121  [61031021121]
U7  ZGM230SB27HGN2R  [QFN44_ZGM230S_SIL]  (parts A,B of 2)

### Ports
ZW_RST (in, see ZW Radio[2B]), ZW_RST (in, see ZW Radio[3D]), ZW_RX (in, see ESP32[2B], SerialConverter[2B], ZW Radio[4D]), ZW_RX (out, see ESP32[2B], SerialConverter[2B], ZW Radio[3B]), ZW_SWCLK (bidir, see ZW Radio[4D]), ZW_SWCLK (see ZW Radio[3A]), ZW_SWDIO (bidir, see ZW Radio[3D]), ZW_SWDIO (see ZW Radio[3A]), ZW_SWO (bidir, see ZW Radio[4D]), ZW_SWO (see ZW Radio[3A]), ZW_TX (in, see ESP32[2B], SerialConverter[2B], ZW Radio[3A]), ZW_TX (out, see ESP32[2B], SerialConverter[2B], ZW Radio[3D])

### Nets
GND: C11.1 C12.1 C13.1 P2.2 U7.2(GND) U7.4(GND) U7.27(GND) U7.44(GND) U7.45(GND) U7.46(GND) U7.47(GND) U7.48(GND)
VCC: C12.2 C13.2 P2.1 U7.25(VREGVDD) U7.26(IOVDD)
ZW_RST: P2.3 U7.1(RESETN) ; port ZW_RST
ZW_RX: P2.4 U7.22(PA09) ; port ZW_RX
ZW_SWCLK: P2.8 U7.13(PA01) ; port ZW_SWCLK
ZW_SWDIO: P2.7 U7.14(PA02) ; port ZW_SWDIO
ZW_SWO: P2.6 U7.15(PA03) ; port ZW_SWO
ZW_TX: P2.5 U7.21(PA08) ; port ZW_TX
NetANT1_1: ANT1.1(RF_Feeding_Point) C11.2 U7.3(RFIO)

Not connected (* = marked no-connect by the designer): ANT1 2(To_trace_element); P2 9* 10*; U7 5(PB06) 6(PB05) 7(PB04) 8(PB03) 9(PB02) 10(PB01) 11(PB00) 12(PA00) 16(PA04) 17(PA05) 18(DECOUPLE) 19(PA06) 20(PA07) 23(PA10) 24(VDCDC) 28(PD05) 29(PD04) 30(PD03) 31(PD02) 32(PD01) 33(PD00) 34(PC00) 35(PC01) 36(PC02) 37(PC03) 38(PC04) 39(PC05) 40(PC06) 41(PC07) 42(PC08) 43(PC09)

### Notes on the sheet
- (in symbol CMP-009-000001-5, part A) 1 of 2
- (in symbol CMP-009-000001-5, part B) 2 of 2

### Library data of the parts
ANT1 = CMP-56579-000002-1: RF ANT CHIP SOLDER SMD; Impedance: 50R; Max Frequency: 928MHz; Number of Pins: 2; Mount: Surface Mount; RoHS Compliant: No; Contact Plating: Tin
C11 = CMP-1036-00283-2: Manufacturer: AVX Interconnect / Elco; Part Number: 08055A2R2CAT2A
C12 C13 = CMP-2000-05016-2: as C1 on sheet ZBT Radio; Voltage Rating (DC): 50V; Package Quantity: 4000; Tolerance: 10%; Voltage Rating: 50V; Dielectric: X7R; Case/Package: 0805; Lead Free: Lead Free; Dielectric Material: Ceramic; Thickness: 0.037inch; Weight: 0.001411oz; Max Operating Temperature: 125°C; REACH SVHC: No SVHC; Mount: Surface Mount; RoHS Compliant: Yes; Depth: 1.25mm; Height: 0.5mm; Case Code (Metric): 2012; Length: 2mm; Termination: Standard; Case Code (Imperial): 0805; Number of Pins: 2; Voltage: 50V; Radiation Hardening: No; Min Operating Temperature: -55°C; Capacitance: 100nF; Width: 1.2mm; Series: MLCC X7R; Packaging: Cut Tape
P2 = CMP-1502-01053-1: as P1 on sheet ZBT Radio; Packaging: TapeandReel; Part Number: 61031021121; Mounting Technology: SMT; Package Reference: 61031021121; Operating Temperature: -40to125degC; Manufacturer URL: http://www.we-online.de; Publisher: WurthElektronik; Datasheet URL: https://katalog.we-online.de/em/datasheet/6103xx21121.pdf; Orientation: Vertical; Row Number: Dual
U7 = CMP-009-000001-5: No Description Available; Mfr_Name: Silicon Labs; RefDes: RefDes; Type: Interface; Source: ZGM230SB27HGN2R.SchLib; Design Item ID: ZGM230SB27HGN2R

## Nets that join several sheets
GND: ZBT Radio (10 pins), ESP32 (19 pins), SerialConverter (8 pins), Connectors (20 pins), PHY (C10.1 R15.2 U6.25), ZW Radio (12 pins)
VCC: ZBT Radio (6 pins), ESP32 (13 pins), SerialConverter (9 pins), Connectors (7 pins), PHY (5 pins), ZW Radio (5 pins)
2102_VB: SerialConverter (U5.8), Connectors (D2.2 J3.A4-B9 J3.B4-A9)
2105_VB: SerialConverter (U4.8), Connectors (D1.2 J2.A4-B9 J2.B4-A9)
ERX_N: Connectors (J1.6 R7.1), PHY (U6.22)
ERX_P: Connectors (J1.3 R8.1), PHY (U6.23)
ESP_RX: ESP32 (MD2.34), SerialConverter (U5.18)
ESP_TX: ESP32 (MD2.35), SerialConverter (U5.17)
ETH_CLK: ESP32 (MD2.28), PHY (U6.5)
ETH_CRS_DV: ESP32 (MD2.12), PHY (R19.1)
ETH_MDC: ESP32 (MD2.37), PHY (U6.13)
ETH_MDIO: ESP32 (MD2.30), PHY (U6.12)
ETH_RXD0: ESP32 (MD2.10), PHY (R16.1)
ETH_RXD1: ESP32 (MD2.11), PHY (R17.1)
ETH_TXD0: ESP32 (MD2.31), PHY (U6.17)
ETH_TXD1: ESP32 (MD2.36), PHY (U6.18)
ETH_TXEN: ESP32 (MD2.33), PHY (U6.16)
ETX_N: Connectors (J1.2 R9.1), PHY (U6.20)
ETX_P: Connectors (J1.1 R10.1), PHY (U6.21)
PHY_INT: ESP32 (MD2.8), PHY (R20.2 U6.14)
PHY_L1: Connectors (J1.9), PHY (U6.3)
PHY_L2: Connectors (J1.12), PHY (U6.2)
PHY_RXER: ESP32 (MD2.27), PHY (U6.10)
USB_D_N: SerialConverter (U5.5), Connectors (J3.A7 J3.B7)
USB_D_P: SerialConverter (U5.4), Connectors (J3.A6 J3.B6)
USB_VB: ESP32 (C5.2 U2.1 U3.3), Connectors (D1.1 D2.1)
USBB_D_N: SerialConverter (U4.4), Connectors (J2.A7 J2.B7)
USBB_D_P: SerialConverter (U4.3), Connectors (J2.A6 J2.B6)
ZB_RX: ZBT Radio (MD1.10 P1.4), ESP32 (MD2.13), SerialConverter (U4.21)
ZB_TX: ZBT Radio (MD1.9 P1.5), ESP32 (MD2.23), SerialConverter (U4.20)
ZW_RX: ESP32 (MD2.26), SerialConverter (U4.13), ZW Radio (P2.4 U7.22)
ZW_TX: ESP32 (MD2.29), SerialConverter (U4.12), ZW Radio (P2.5 U7.21)